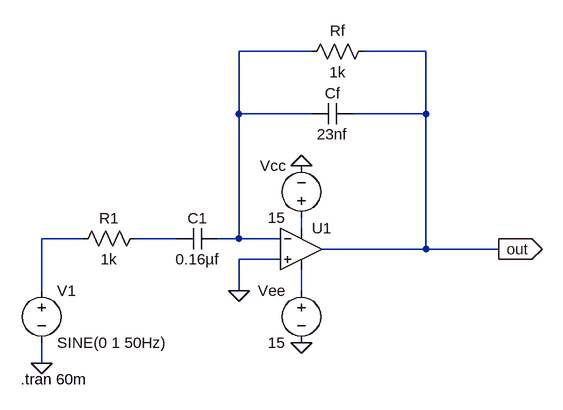
[diagram p0: schematic Differentiator_Using_OpAmp.asc]
Differentiator_Using_OpAmp.asc, the LTspice schematic file:
Version 4.1
SHEET 1 880 680
WIRE 224 -112 112 -112
WIRE 400 -112 304 -112
WIRE 112 -16 112 -112
WIRE 224 -16 112 -16
WIRE 400 -16 400 -112
WIRE 400 -16 288 -16
WIRE 208 160 208 144
WIRE -128 176 -192 176
WIRE 16 176 -48 176
WIRE 112 176 112 -16
WIRE 112 176 80 176
WIRE 176 176 112 176
WIRE 400 192 400 -16
WIRE 400 192 240 192
WIRE 512 192 400 192
WIRE 176 208 112 208
WIRE -192 256 -192 176
WIRE 112 256 112 208
WIRE 208 256 208 224
WIRE -192 368 -192 336
FLAG -192 368 0
FLAG 112 256 0
FLAG 512 192 out
IOPIN 512 192 Out
FLAG 208 336 0
FLAG 208 64 0
SYMBOL OpAmps\\UniversalOpAmp2 208 192 R0
SYMATTR InstName U1
SYMBOL cap 80 160 R90
WINDOW 0 0 32 VBottom 2
WINDOW 3 32 32 VTop 2
SYMATTR InstName C1
SYMATTR Value 0.16µf
SYMBOL res -32 160 R90
WINDOW 0 0 56 VBottom 2
WINDOW 3 32 56 VTop 2
SYMATTR InstName R1
SYMATTR Value 1k
SYMBOL voltage -192 240 R0
WINDOW 123 0 0 Left 0
WINDOW 39 0 0 Left 0
SYMATTR InstName V1
SYMATTR Value SINE(0 1 50Hz)
SYMBOL cap 288 -32 R90
WINDOW 0 0 32 VBottom 2
WINDOW 3 32 32 VTop 2
SYMATTR InstName Cf
SYMATTR Value 23nf
SYMBOL res 320 -128 R90
WINDOW 0 0 56 VBottom 2
WINDOW 3 32 56 VTop 2
SYMATTR InstName Rf
SYMATTR Value 1k
SYMBOL voltage 208 160 R180
WINDOW 0 24 96 Left 2
WINDOW 3 24 16 Left 2
WINDOW 123 0 0 Left 0
WINDOW 39 0 0 Left 0
SYMATTR InstName Vcc
SYMATTR Value 15
SYMBOL voltage 208 240 M0
WINDOW 123 0 0 Left 0
WINDOW 39 0 0 Left 0
SYMATTR InstName Vee
SYMATTR Value 15
TEXT -224 392 Left 2 !.tran 60m

The netlist it stands for:
* Differentiator_Using_OpAmp.asc
X§U1 0 N001 N002 N005 out level2 Avol=1Meg GBW=10Meg Slew=10Meg Ilimit=25m Rail=0 Vos=0 En=0 Enk=0 In=0 Ink=0 Rin=500Meg  ; pins In+ In- V+ V- OUT
C1 N001 N004 0.16µf
R1 N004 N003 1k
V1 N003 0 SINE(0 1 50Hz)
Cf out N001 23nf
Rf out N001 1k
Vcc N002 0 15
Vee N005 0 15
.tran 60m
.lib UniversalOpAmp2.lib
.backanno
.end